# EAGLE design Modem_V20_5x5 (EAGLE 7.1.0)
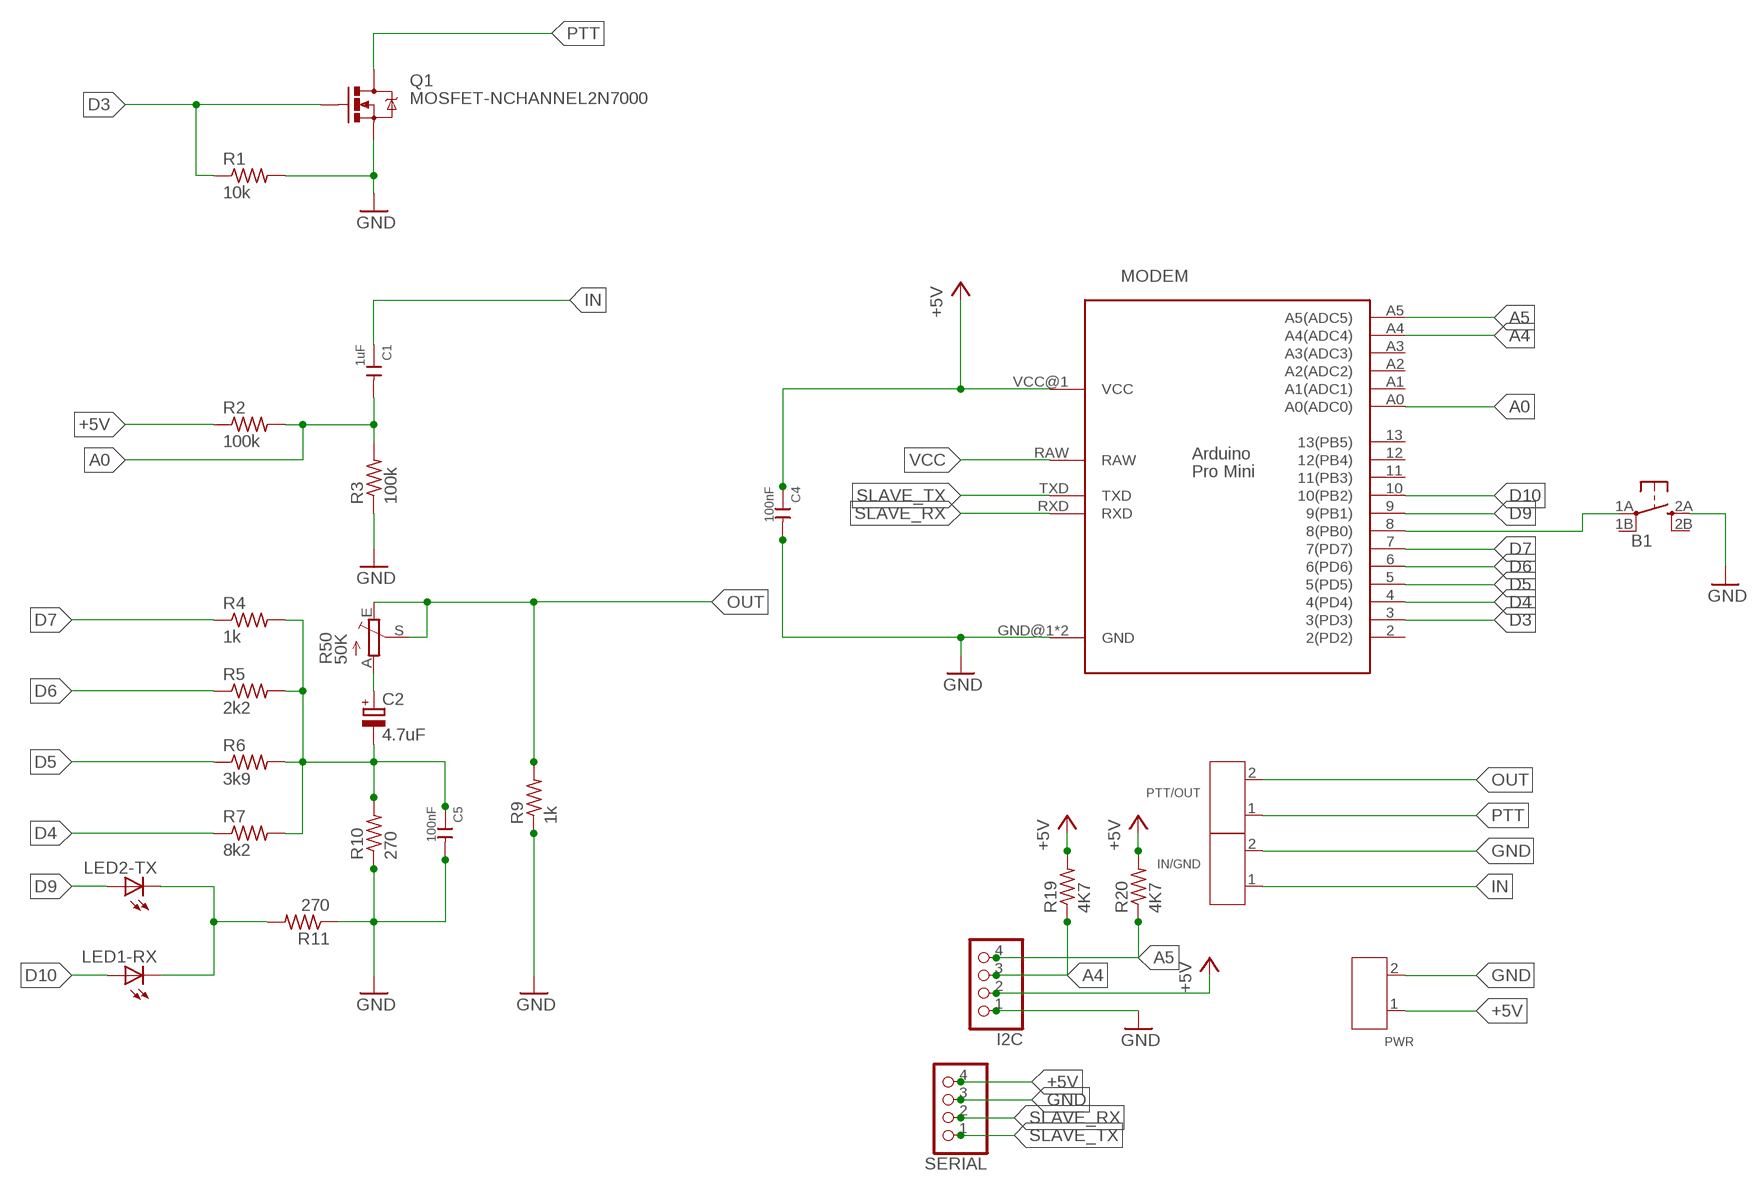
[diagram p0: schematic, sheet 1]

## Parts
B1  TACTILETACT-6X6-PTH  [TACTILE-PTH]
C1  1uF  CERAMIC-10UF-25V-10%-X5R(1206)  [C1206]
C2  4.7uF  CPOL-EUE2.5-6  [E2,5-6]
C4  100nF  CERAMIC-10UF-25V-10%-X5R(1206)  [C1206]
C5  100nF  CERAMIC-10UF-25V-10%-X5R(1206)  [C1206]
I2C  PINHD-1X4  [1X04]
IN/GND  SCREW-TERMINAL-GREEN(2P-3.5)  [H2-3.5-7.0X7.0MM]
LED1-RX  LED1206  [LED-1206]
LED2-TX  LED1206  [LED-1206]
MODEM  PRO-MINI  [PRO-MINI]
PTT/OUT  SCREW-TERMINAL-GREEN(2P-3.5)  [H2-3.5-7.0X7.0MM]
PWR  SCREW-TERMINAL-GREEN(2P-3.5)  [H2-3.5-7.0X7.0MM]
Q1  MOSFET-NCHANNEL2N7000  [TO-92]
R1  10k  R-US_R1206  [R1206]
R2  100k  R-US_R1206  [R1206]
R3  100k  R-US_R1206  [R1206]
R4  1k  R-US_R1206  [R1206]
R5  2k2  R-US_R1206  [R1206]
R6  3k9  R-US_R1206  [R1206]
R7  8k2  R-US_R1206  [R1206]
R9  1k  R-US_R1206  [R1206]
R10  270  R-US_R1206  [R1206]
R11  270  R-US_R1206  [R1206]
R19  4K7  R-US_R1206  [R1206]
R20  4K7  R-US_R1206  [R1206]
R50  50K  TRIM_EU-CA6V  [CA6V]
SERIAL  PINHD-1X4  [1X04]

## Nets
+5V: C4.1 I2C.2 MODEM.VCC@1(VCC) PWR.1 R2.1 R19.2 R20.2 SERIAL.4
A0: C1.2 MODEM.A0(A0(ADC0)) R2.2 R3.2
A4: I2C.3 MODEM.A4(A4(ADC4)) R19.1
A5: I2C.4 MODEM.A5(A5(ADC5)) R20.1
D3: MODEM.3(3(PD3)) Q1.2(G) R1.1
D4: MODEM.4(4(PD4)) R7.1
D5: MODEM.5(5(PD5)) R6.1
D6: MODEM.6(6(PD6)) R5.1
D7: MODEM.7(7(PD7)) R4.1
D8: B1.1A MODEM.8(8(PB0))
D9: LED2-TX.A MODEM.9(9(PB1))
D10: LED1-RX.A MODEM.10(10(PB2))
GND: B1.2A C4.2 C5.2 I2C.1 IN/GND.2 MODEM.GND@1(GND) MODEM.GND@2(GND) PWR.2 Q1.1(S) R1.2 R3.1 R9.1 R10.1 R11.1 SERIAL.3
IN: C1.1 IN/GND.1
N$5: C2.+ R50.A
N$8: LED1-RX.C LED2-TX.C R11.2
N$9: C2.- C5.1 R4.2 R5.2 R6.2 R7.2 R10.2
OUT: PTT/OUT.2 R9.2 R50.E R50.S
PTT: PTT/OUT.1 Q1.3(D)
SLAVE_RX: MODEM.RXD SERIAL.2
SLAVE_TX: MODEM.TXD SERIAL.1
VCC: MODEM.RAW
Unconnected: B1.1B B1.2B MODEM.2(2(PD2)) MODEM.11(11(PB3)) MODEM.12(12(PB4)) MODEM.13(13(PB5)) MODEM.A1(A1(ADC1)) MODEM.A2(A2(ADC2)) MODEM.A3(A3(ADC3))

## Library data of the parts
B1 = SmallRoomLabs:TACTILE
C1 = Seeed-Capacitor-2016:CERAMIC-10UF-25V-10%-X5R(1206): 302010181; EAGLEUP: CAP_8mm; MPN: CC1206KKX5R8BB106; VALUE: 10uf
C2 = resistor:CPOL-EU: POLARIZED CAPACITOR, European symbol; EAGLEUP: CAP_8mm
C4 C5 = Seeed-Capacitor-2016:CERAMIC-10UF-25V-10%-X5R(1206): 302010181; MPN: CC1206KKX5R8BB106; VALUE: 10uf
I2C SERIAL = pinhead:PINHD-1X4: PIN HEADER
IN/GND PTT/OUT PWR = Seeed-Connector -2016:SCREW-TERMINAL-GREEN(2P-3.5): 320110028; VALUE: GREEN-2P-3.5
LED1-RX LED2-TX = SparkFun:LED: LEDs Standard schematic elements and footprints for 5mm, 3mm, 1206, and 0603 sized LEDs. 5mm - Spark Fun Electronics SKU : COM-00529 (and others)
MODEM = Arduino:PRO-MINI; EAGLEUP: MINIPRO
Q1 = SparkFun-DiscreteSemi:MOSFET-NCHANNEL: Common NMOSFET Parts MFG P/N Store ID Prod ID FDD8780 TRANS-09984 SI7820DN TRANS-11055 FDS6630A IC-08089 2N7002PW TRANS-11151 FQP30N06L COM-10213 TRANS-10060 BSS123LT1G TRANS-08345 BSS138 TRANS-00830 BS170 2N7000; EAGLEUP: TO92
R1-R7 R9-R11 R19 R20 = resistor:R-US_: RESISTOR, American symbol
R50 = pot:TRIM_EU-: POTENTIOMETER

## Board
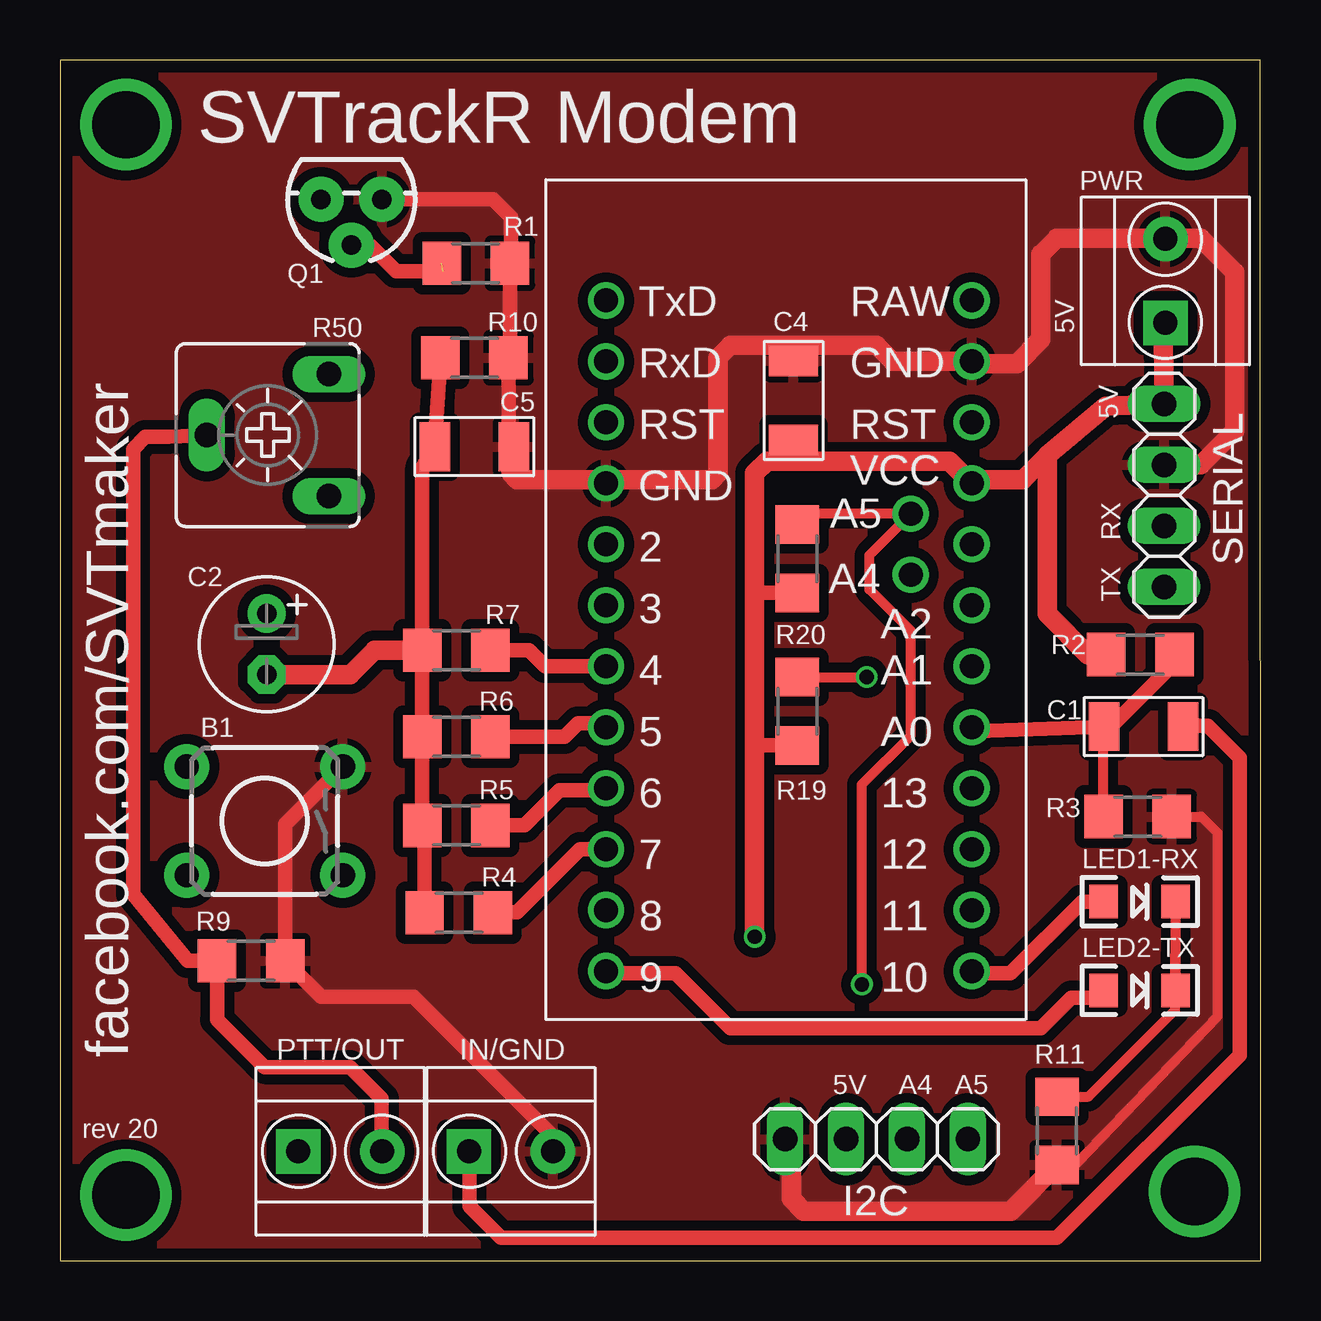
[diagram p1: board, top side]
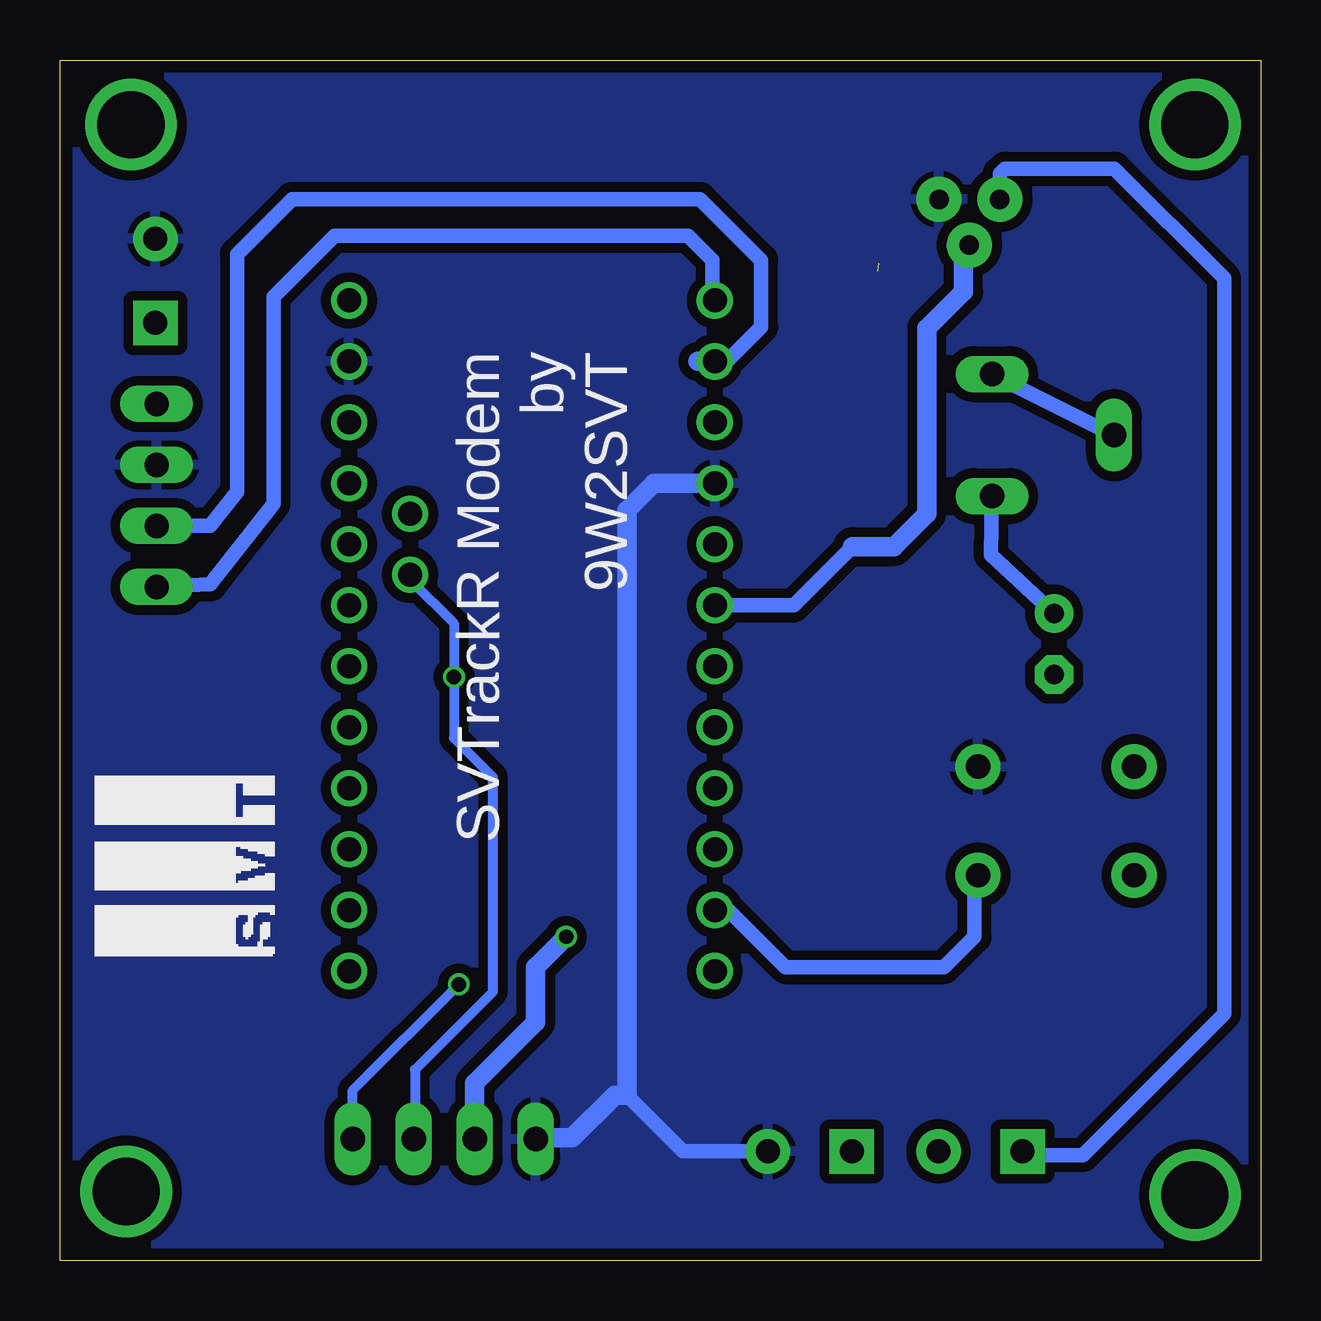
[diagram p2: board, bottom side, seen from below]

Size 50.05 x 50.04 mm. Coordinates in mm from the lower left corner, seen from the top.
Outline: 0,0 50.05,0.01 50.04,50.04 0,50.04 0,0
Copper layers (1*16): Top 0.035mm / dielectric 1.5mm / Bottom 0.035mm
Design rules "Smart-Prototyping": minimum track width 7mil, minimum drill 12mil, track to track 7mil, track to pad 7mil, pad to pad 7mil, via to via 7mil, smd to smd 0mil, copper to edge 20mil, drill to drill 10mil, minimum pad ring 10mil, minimum via ring 6mil, stop-mask expansion 2mil, vias tented up to drill 25mil, thermal gap 10mil

### Footprints (pad centres in the part's own frame; a part is rotated, then mirrored left to right if it is on the bottom)
TACTILE-PTH = drill 1.016 pad 1.88: 1A -3.251,2.261; 1B 3.251,2.261; 2A -3.251,-2.261; 2B 3.251,-2.261
C1206 = smd 1.27 x 2.032: 1 -1.651,0; 2 1.651,0
E2,5-6 = drill 0.813 pad 1.6: + -1.27,0 | drill 0.813 pad 1.6 octagon: - 1.27,0
1X04 = drill 1.016 long: 1 -3.81,0; 2 -1.27,0; 3 1.27,0; 4 3.81,0
H2-3.5-7.0X7.0MM = drill 1 pad 1.85 square: 1 -1.75,0 | drill 1 pad 1.85: 2 1.75,0
LED-1206 = smd 1.2 x 1.4: A -1.5,0; C 1.5,0
PRO-MINI = drill 1: 2 2.48,19.794; 3 2.48,17.254; 4 2.48,14.714; 5 2.48,12.174; 6 2.48,9.634; 7 2.48,7.094; 8 2.48,4.554; 9 2.48,2.014; 10 17.72,2.014; 11 17.72,4.554; 12 17.72,7.094; 13 17.72,9.634; A0 17.72,12.174; A1 17.72,14.714; A2 17.72,17.254; A3 17.72,19.794; A4 15.18,18.524; A5 15.18,21.064; GND@1 2.48,22.334; GND@2 17.72,27.414; RAW 17.72,29.954; RST@1 2.48,24.874; RST@2 17.72,24.874; RXD 2.48,27.414; TXD 2.48,29.954; VCC@1 17.72,22.334
TO-92 = drill 0.813 pad 1.88: 1 -1.27,0; 2 0,1.905; 3 1.27,0
R1206 = smd 1.6 x 1.803: 1 -1.422,0; 2 1.422,0
CA6V = drill 1.016 long: A -2.54,-2.54; E 2.54,-2.54; S 0,2.54

### Placement (x,y rotation side)
B1  8.53,18.33 180 top
C1  45.17,22.27 180 top
C2  8.62,25.7 270 top
C4  30.58,35.85 90 top
C5  17.27,33.93 0 top
I2C  34.04,5.08 0 top
IN/GND  18.8,4.57 0 top
LED1-RX  45,14.97 0 top
LED2-TX  45,11.27 0 top
MODEM  20.28,10.07 0 top
PTT/OUT  11.68,4.57 0 top
PWR  46.08,40.84 90 top
Q1  12.15,44.23 180 top
R1  17.33,41.57 0 top
R2  45.03,25.27 0 top
R3  44.92,18.52 180 top
R4  16.62,14.51 180 top
R5  16.52,18.15 180 top
R6  16.52,21.84 180 top
R7  16.52,25.45 180 top
R9  7.97,12.51 180 top
R10  17.27,37.64 180 top
R11  41.56,5.42 90 top
R19  30.73,22.91 270 top
R20  30.73,29.26 270 top
R50  8.66,34.41 90 top
SERIAL  46.02,31.9 90 top

### Tracks (layer width: path | path; a pad name or v marks a point on that pad's centre or on a via)
+5V  (via drill 0.6)
  Top 0.61: C4.1 30.88,33.43 34.29,33.32 | 38,32.46 MODEM.VCC@1 38.1,32.3 | R20.2 29.06,27.83 28.96,27.73 | R19.2 29.06,21.48 28.96,21.38
  Top 0.813: v28.96,13.51 28.96,21.38 28.96,27.73 28.96,32.81 29.46,33.32 34.29,33.32 37.08,33.32 MODEM.VCC@1 38.16,32.56 40.13,32.56 41.15,33.57 | 41.15,33.57 43.59,35.61 SERIAL.4 45.97,39.44 PWR.1 | R2.1 42.85,25.27 41.15,26.97 41.15,33.57
  Bottom 0.813: v28.96,13.51 30.23,12.24 30.23,9.95 32.77,7.41 I2C.2
A0
  Top 0.406: R3.2 43.49,22.24 C1.2 | 38.08,22.32 MODEM.A0
  Top 0.61: MODEM.A0 38.18,22.06 C1.2 43.61,22.06 46.23,24.68 46.23,25.04 R2.2
A4  (via drill 0.6)
  Top 0.406: R19.1 v33.63,24.33
  Bottom 0.406: MODEM.A4 35.46,28.39 33.63,26.56 33.63,24.63 v33.63,24.33 33.63,21.79 32,20.16 32,11.22 35.26,7.97 35.26,5.13 I2C.3
A5  (via drill 0.6)
  Top 0.406: R20.1 31.19,31.13 MODEM.A5 33.73,29.4 33.73,27.99 35.46,26.26 35.46,21.89 33.43,19.86 v33.43,11.53
  Bottom 0.406: I2C.4 37.85,7.11 v33.43,11.53
D3  (1 unrouted)
  Top 0.61: 15.96,41.25 14,41.25 12.92,42.33 Q1.2
  Bottom 0.406: Q1.2 12.92,42.33
  Bottom 0.61: MODEM.3 19.46,27.32 17.02,29.76 | 12.19,42.28 Q1.2
  Bottom 0.813: 17.02,29.76 15.29,29.76 13.92,31.14 13.92,38.86 12.39,40.38 12.39,42.08 Q1.2
D4
  Top 0.61: MODEM.4 20.22,24.78 19.56,25.45 R7.1
D5
  Top 0.61: R6.1 21.03,21.84 21.59,22.4 22.6,22.4 MODEM.5
D6
  Top 0.61: R5.1 19.37,18.15 20.83,19.6 22.66,19.6 MODEM.6
D7
  Top 0.61: MODEM.7 21.69,17.16 19.05,14.52 18.05,14.52 R4.1
D8
  Bottom 0.61: MODEM.8 22.19,14.62 19.81,12.24 13.21,12.24 11.94,13.51 11.94,16.53 B1.1A
D9
  Top 0.406: 22.92,12.24 MODEM.9
  Top 0.61: MODEM.9 22.86,11.98 25.65,11.98 27.94,9.7 40.89,9.7 42.16,10.97 43.2,10.97 LED2-TX.A
D10
  Top 0.61: LED1-RX.A 42.61,14.97 39.62,11.98 38.1,11.98 MODEM.10
GND
  Top 0.406: 41.66,3.9 R11.1 41.67,4.11 42.42,4.11 48.26,10.21 48.26,17.83 47.57,18.52 R3.1
  Top 0.61: 38.1,37.38 MODEM.GND@2 | Q1.1 18.04,44.23 18.8,43.48 18.8,41.61 R1.2 18.76,37.7 R10.1 18.69,33.85 C5.2 18.67,33.44 | 22.6,32.56 MODEM.GND@1 | IN/GND.2 20.55,5.21 14.73,11.02 10.88,11.02 R9.1 9.39,18.2 B1.2A
  Top 0.813: 38.1,37.38 39.88,37.38 40.89,38.4 40.89,41.96 41.55,42.62 46.05,42.62 PWR.2 46.1,42.62 47.55,42.62 48.97,41.19 48.97,34.59 47.55,33.17 SERIAL.3 | R11.1 39.64,2.08 30.99,2.08 30.48,2.59 30.48,4.83 I2C.1 | 22.6,32.56 19.05,32.56 18.8,32.81 18.8,33.7 C5.2 | MODEM.GND@2 34.7,37.48 34.04,38.15 31,38.15 | 31,38.15 C4.2 | MODEM.GND@1 22.92,32.56 27.18,32.56 27.43,32.81 27.43,37.64 27.94,38.15 31,38.15
  Bottom 0.61: IN/GND.2 24.08,4.57 26.42,6.9
  Bottom 0.813: MODEM.GND@1 25.3,32.4 26.42,31.29 26.42,6.9 26.92,6.9 28.7,5.13 30.18,5.13 I2C.1
  pour Bottom (isolate 0.406): 0.3,49.93 49.99,49.93 49.99,0.15 0.3,0.15
  pour Top (isolate 0.406): 0.41,49.83 49.78,49.83 49.78,0.15 0.51,0.15 0.51,49.73
IN
  Top 0.61: C1.1 46.85,22.3 47.85,22.3 49.17,20.98 49.17,8.58 41.55,0.96 18.39,0.96 17.07,2.28 17.07,4.54 IN/GND.1
N$1  (via drill 2.8)
  other vias: 2.75,2.75
N$2  (via drill 2.8)
  other vias: 2.75,47.35
N$3  (via drill 2.8)
  other vias: 47.09,47.35
N$4  (via drill 2.8)
  other vias: 47.29,2.9
N$5
  Bottom 0.61: C2.+ 11.26,29.43 R50.A
N$8
  Top 0.406: LED1-RX.C LED2-TX.C 46.48,12.78 46.48,10.46 42.87,6.84 R11.2
N$9
  Top 0.61: R4.2 15.2,18.05 R5.2 R6.2 R7.2 15.1,33.05 C5.1 15.87,37.62 R10.2
  Top 0.813: R7.2 13.11,25.45 12.09,24.43 C2.-
OUT
  Top 0.61: R50.S 4.52,34.34 3.56,34.34 3.05,33.83 3.05,15.29 5.32,12.51 R9.2 6.55,10.06 8.53,8.07 12.09,8.07 13.41,6.75 13.41,4.59 PTT/OUT.2
  Bottom 0.61: R50.E R50.S
PTT
  Bottom 0.61: Q1.3 10.88,45.3 10.67,45.51 6.1,45.51 1.52,40.94 1.52,10.31 7.42,4.42 9.78,4.42 PTT/OUT.1
SLAVE_RX
  Bottom 0.61: MODEM.RXD 22.96,37.48 | 23.46,37.48 22.26,37.48 20.83,38.91 20.83,41.7 23.37,44.24 40.39,44.24 42.67,41.96 42.67,32.05 43.79,30.63 SERIAL.2
  Bottom 0.813: MODEM.RXD 23.46,37.48
SLAVE_TX
  Bottom 0.61: 22.86,39.92 MODEM.TXD 22.86,40.12 22.86,41.7 23.88,42.72 38.61,42.72 41.15,40.18 41.15,31.54 43.79,28.19 SERIAL.1

### Text on the board
tNames: SVTrackR Modem | 5V | 5V | RX | TX | facebook.com/SVTmaker | 5V | A4 | A5 | rev 20
bNames: SVTrackR Modem / by / 9W2SVT